# Altium schematic sheet AC_sample.SchDoc
size A4; SheetNumber: 1; SheetTotal: 1
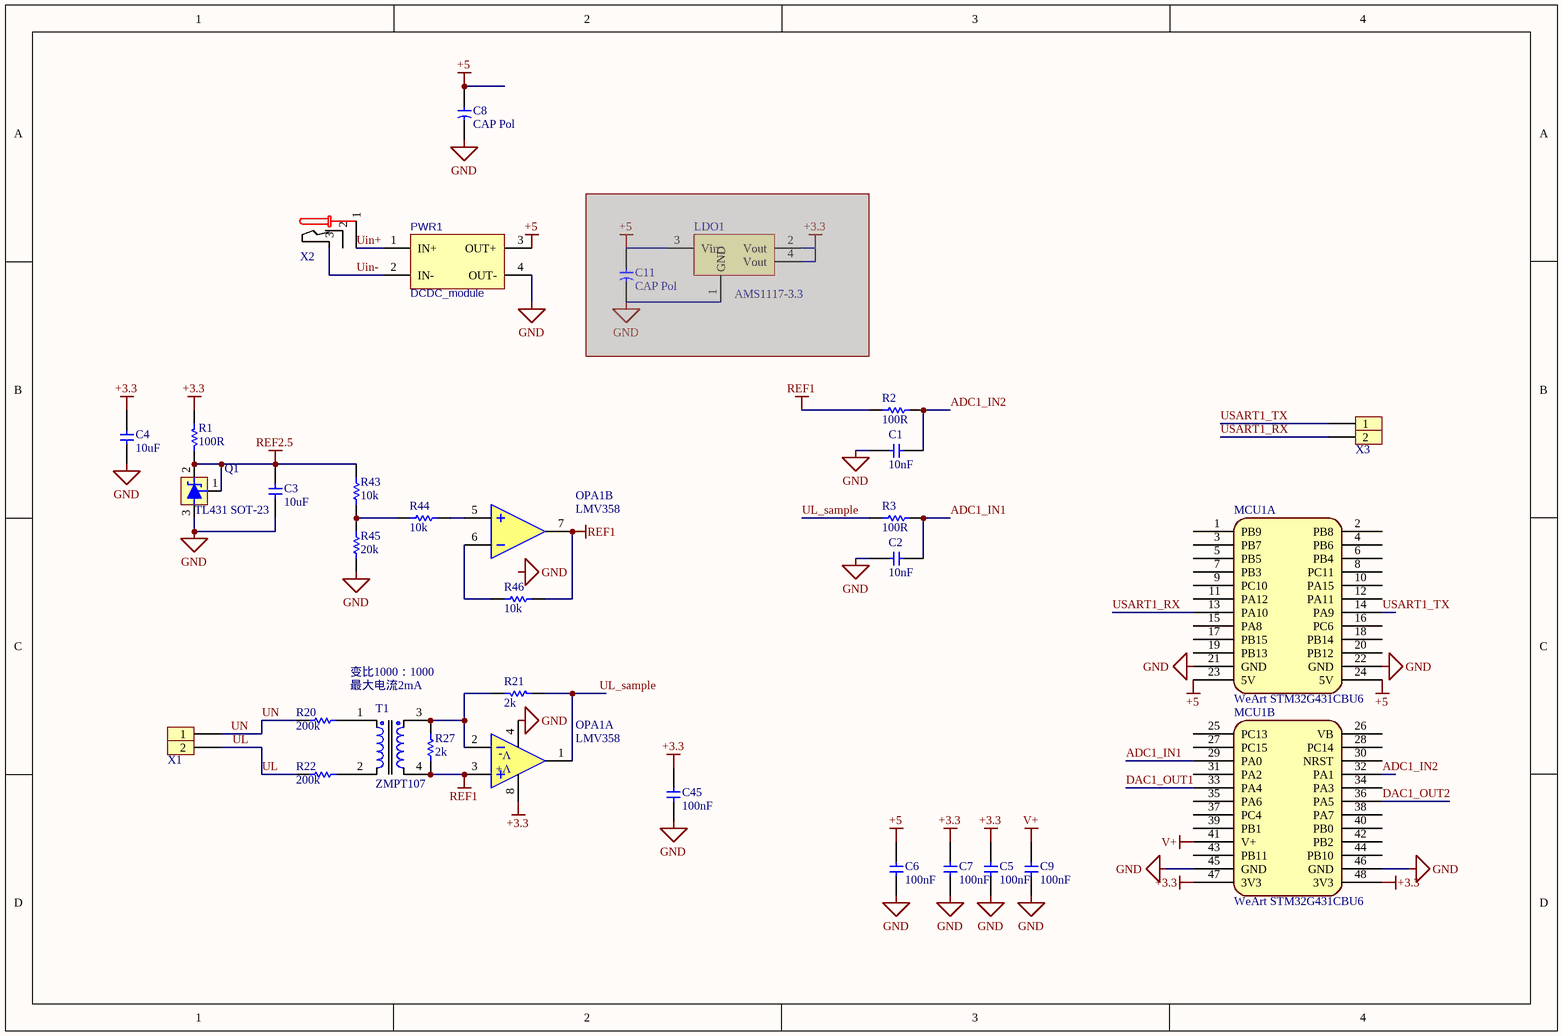
[diagram p0: AC_sample.SchDoc]

## Parts
C1  10nF  [0603C]
C2  10nF  [0603C]
C3  10uF  [0805C]
C4  10uF  [0805C]
C5  100nF  [0603C]
C6  100nF  [0603C]
C7  100nF  [0603C]
C8  CAP Pol  [CAP-ALU-SMD-06.3]
C9  100nF  [0603C]
C11  CAP Pol  [CAP-ALU-SMD-06.3]  (masked out: inside a compile mask, not in the netlist)
C45  100nF  [0603C]
LDO1  AMS1117-3.3  [sot-223]  (masked out: inside a compile mask, not in the netlist)
MCU1  WeArt STM32G431CBU6  [WeArt STM32G431CBU6]  (parts A,B of 2)
OPA1  LMV358  [SO-08 - P1.27MM]  (parts A,B of 2)
PWR1  DCDC_module  [MiniDCDC]
Q1  TL431 SOT-23  [sot-23]
R1  100R  [0805R]
R2  100R  [0805R]
R3  100R  [0805R]
R20  200k  [1206R]
R21  2k  [0805R]
R22  200k  [1206R]
R27  2k  [0805R]
R43  10k  [0805R]
R44  10k  [0805R]
R45  20k  [0805R]
R46  10k  [0805R]
T1  ZMPT107  [ZMPT107-1]
X1  Header 2  [2EDGRG-5.08-02P]  (value not drawn)
X2  DC_Port  [DC-5.5mm]  (value not drawn)
X3  Header 2  [HDR1X2]  (value not drawn)

## Nets
+3.3: C4.1 C5.1 C7.1 C45.1 MCU1.47(3V3) MCU1.48(3V3) OPA1.8(V+) R1.2
+5: C6.1 C8.1 MCU1.23(5V) MCU1.24(5V) PWR1.3(OUT+)
GND: C1.2 C2.2 C3.2 C4.2 C5.2 C6.2 C7.2 C8.2 C9.2 C45.2 MCU1.21(GND) MCU1.22(GND) MCU1.45(GND) MCU1.46(GND) OPA1.4(V-) PWR1.4(OUT-) Q1.3(A) R45.1
REF1: OPA1.3(IN+) OPA1.7(OUT) R2.1 R27.2 R46.2 T1.4
REF2.5: C3.1 Q1.1(K) Q1.2(REF) R1.1 R43.2
V+: C9.1 MCU1.41(V+)
ADC1_IN1: C2.1 MCU1.29(PA0) R3.2
ADC1_IN2: C1.1 MCU1.32(PA1) R2.2
DAC1_OUT1: MCU1.33(PA4)
DAC1_OUT2: MCU1.36(PA5)
Uin+: PWR1.1(IN+) X2.1
Uin-: PWR1.2(IN-) X2.3
UL: R22.2 X1.2
UL_sample: OPA1.1(OUT) R3.1 R21.1
UN: R20.2 X1.1
USART1_RX: MCU1.13(PA10) X3.2
USART1_TX: MCU1.14(PA9) X3.1
NetOPA1_2: OPA1.2(IN-) R21.2 R27.1 T1.3
NetOPA1_5: OPA1.5(IN+) R44.2
NetOPA1_6: OPA1.6(IN-) R46.1
NetR20_1: R20.1 T1.1
NetR22_1: R22.1 T1.2
NetR43_1: R43.1 R44.1 R45.2

Not connected (* = marked no-connect by the designer): MCU1 1(PB9) 2(PB8) 3(PB7) 4(PB6) 5(PB5) 6(PB4) 7(PB3) 8(PC11) 9(PC10) 10(PA15) 11(PA12) 12(PA11) 15(PA8) 16(PC6) 17(PB15) 18(PB14) 19(PB13) 20(PB12) 25(PC13) 26(VB) 27(PC15) 28(PC14) 30(NRST) 31(PA2) 34(PA3) 35(PA6) 37(PC4) 38(PA7) 39(PB1) 40(PB0) 42(PB2) 43(PB11) 44(PB10); X2 2

## Notes on the sheet
- 变比1000：1000
- 最大电流2mA
- Labels drawn without touching a wire or pin: GND

## Library data of the parts
C1-C7 C9 C45 = CAP
LDO1 = AMS1117: 名称: 输出稳压器; 封装: SOT-223; 型号: AMS1117-3.3
OPA1 = LM258: Operational Amplifier; Manufacture: TI; Value: *; Document: *; Published: 20101030; Publisher: zly; Type: LM258D/OPA2227/tlc082
PWR1 = DCDC_module: BOM_Manufacturer: XLSEMI; BOM_Manufacturer Part: XL2596T-12E1; SMT Type: Extend; BOM_Supplier: LCSC; image: //image.lceda.cn/szlcsc/C74187.jpg; BOM_Supplier Part: C74187; BOM_JLCPCB SMD: Yes; spicePre: U; spiceSymbolName: XL2596T-12E1
Q1 = TL431 SOT-23: Manufacture: TEXAS INSTRUMENTS; Document: *; Published: *; Publisher: *; Type: *; Value: *
R1-R3 R20-R22 R27 R45 = Res1: Resistor; Value: 10K; Published: 20101211; Revision: July-2002: Re-released for DXP Platform.; Publisher: zly; TYPE: *; Manufacture: *; Document: *
R43 R44 R46 = Res1: Resistor; Published: 20101211; Revision: July-2002: Re-released for DXP Platform.; Publisher: zly; Value: 10K; TYPE: *; Manufacture: *; Document: *
T1 = Trans: DVDI-001; Published: 20101030; Publisher: zly; Document: *; Manufacture: *; Type: *; Value: *
X1 X3 = Header 2: Value: *; Type: *; Publisher: zly; Published: 20101030; Manufacture: *; Document: *
X2 = DC_Port: Document: *; Manufacture: *; Published: 20101030; Publisher: zly; Type: *; Value: *